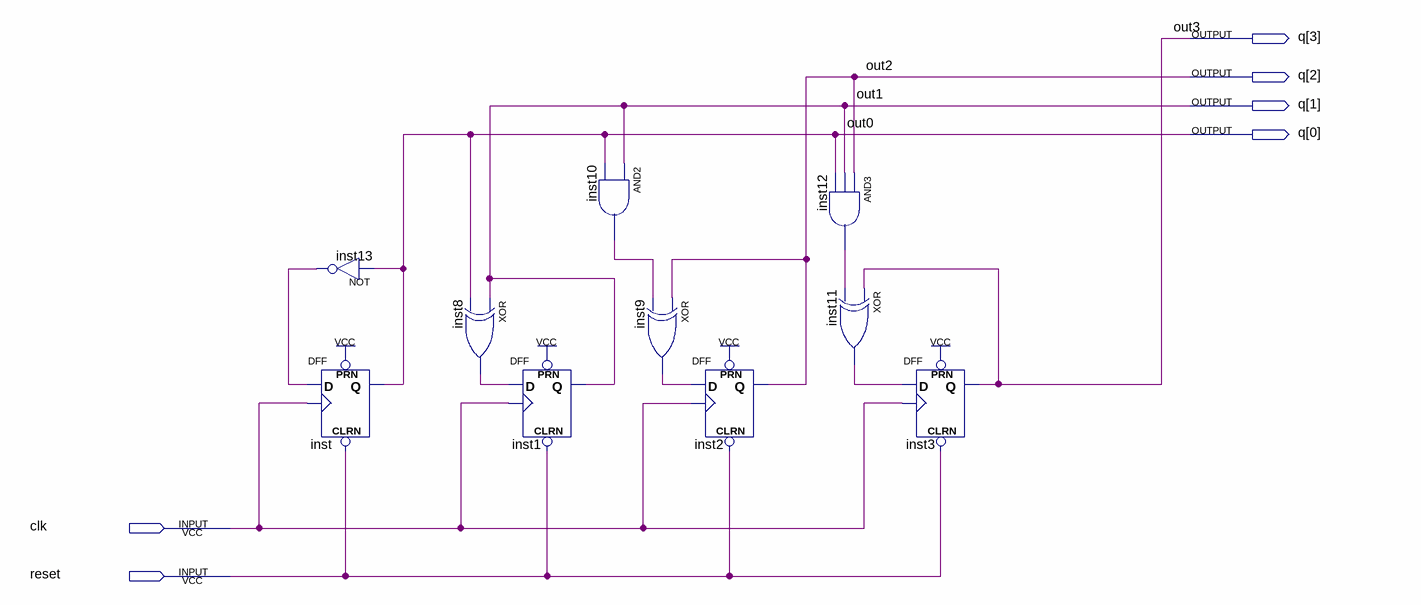
[diagram p0: schematic sheet]
// Quartus schematic syncSchematic.bdf as structural Verilog: 10 symbols, 6 pins
module syncSchematic (
  input  clk,
  input  reset,
  output [3:0] q
);

  wire inst8_out, inst9_out, inst10_out, inst11_out, inst12_out, inst13_out;

  not inst13 (inst13_out, q[0]);
  DFF inst (.CLRN(reset), .CLK(clk), .D(inst13_out), .PRN(1'b1), .Q(q[0]));
  xor inst8 (inst8_out, q[1], q[0]);
  DFF inst1 (.CLRN(reset), .CLK(clk), .D(inst8_out), .PRN(1'b1), .Q(q[1]));
  and inst10 (inst10_out, q[1], q[0]);
  xor inst9 (inst9_out, q[2], inst10_out);
  DFF inst2 (.CLRN(reset), .CLK(clk), .D(inst9_out), .PRN(1'b1), .Q(q[2]));
  and inst12 (inst12_out, q[2], q[1], q[0]);
  xor inst11 (inst11_out, q[3], inst12_out);
  DFF inst3 (.CLRN(reset), .CLK(clk), .D(inst11_out), .PRN(1'b1), .Q(q[3]));

  // Other names for the same wires on the sheet: out0 = q[0]; out1 = q[1]; out2 = q[2]; out3 = q[3]
endmodule
